# EAGLE design budicLED (EAGLE 7.2.0)
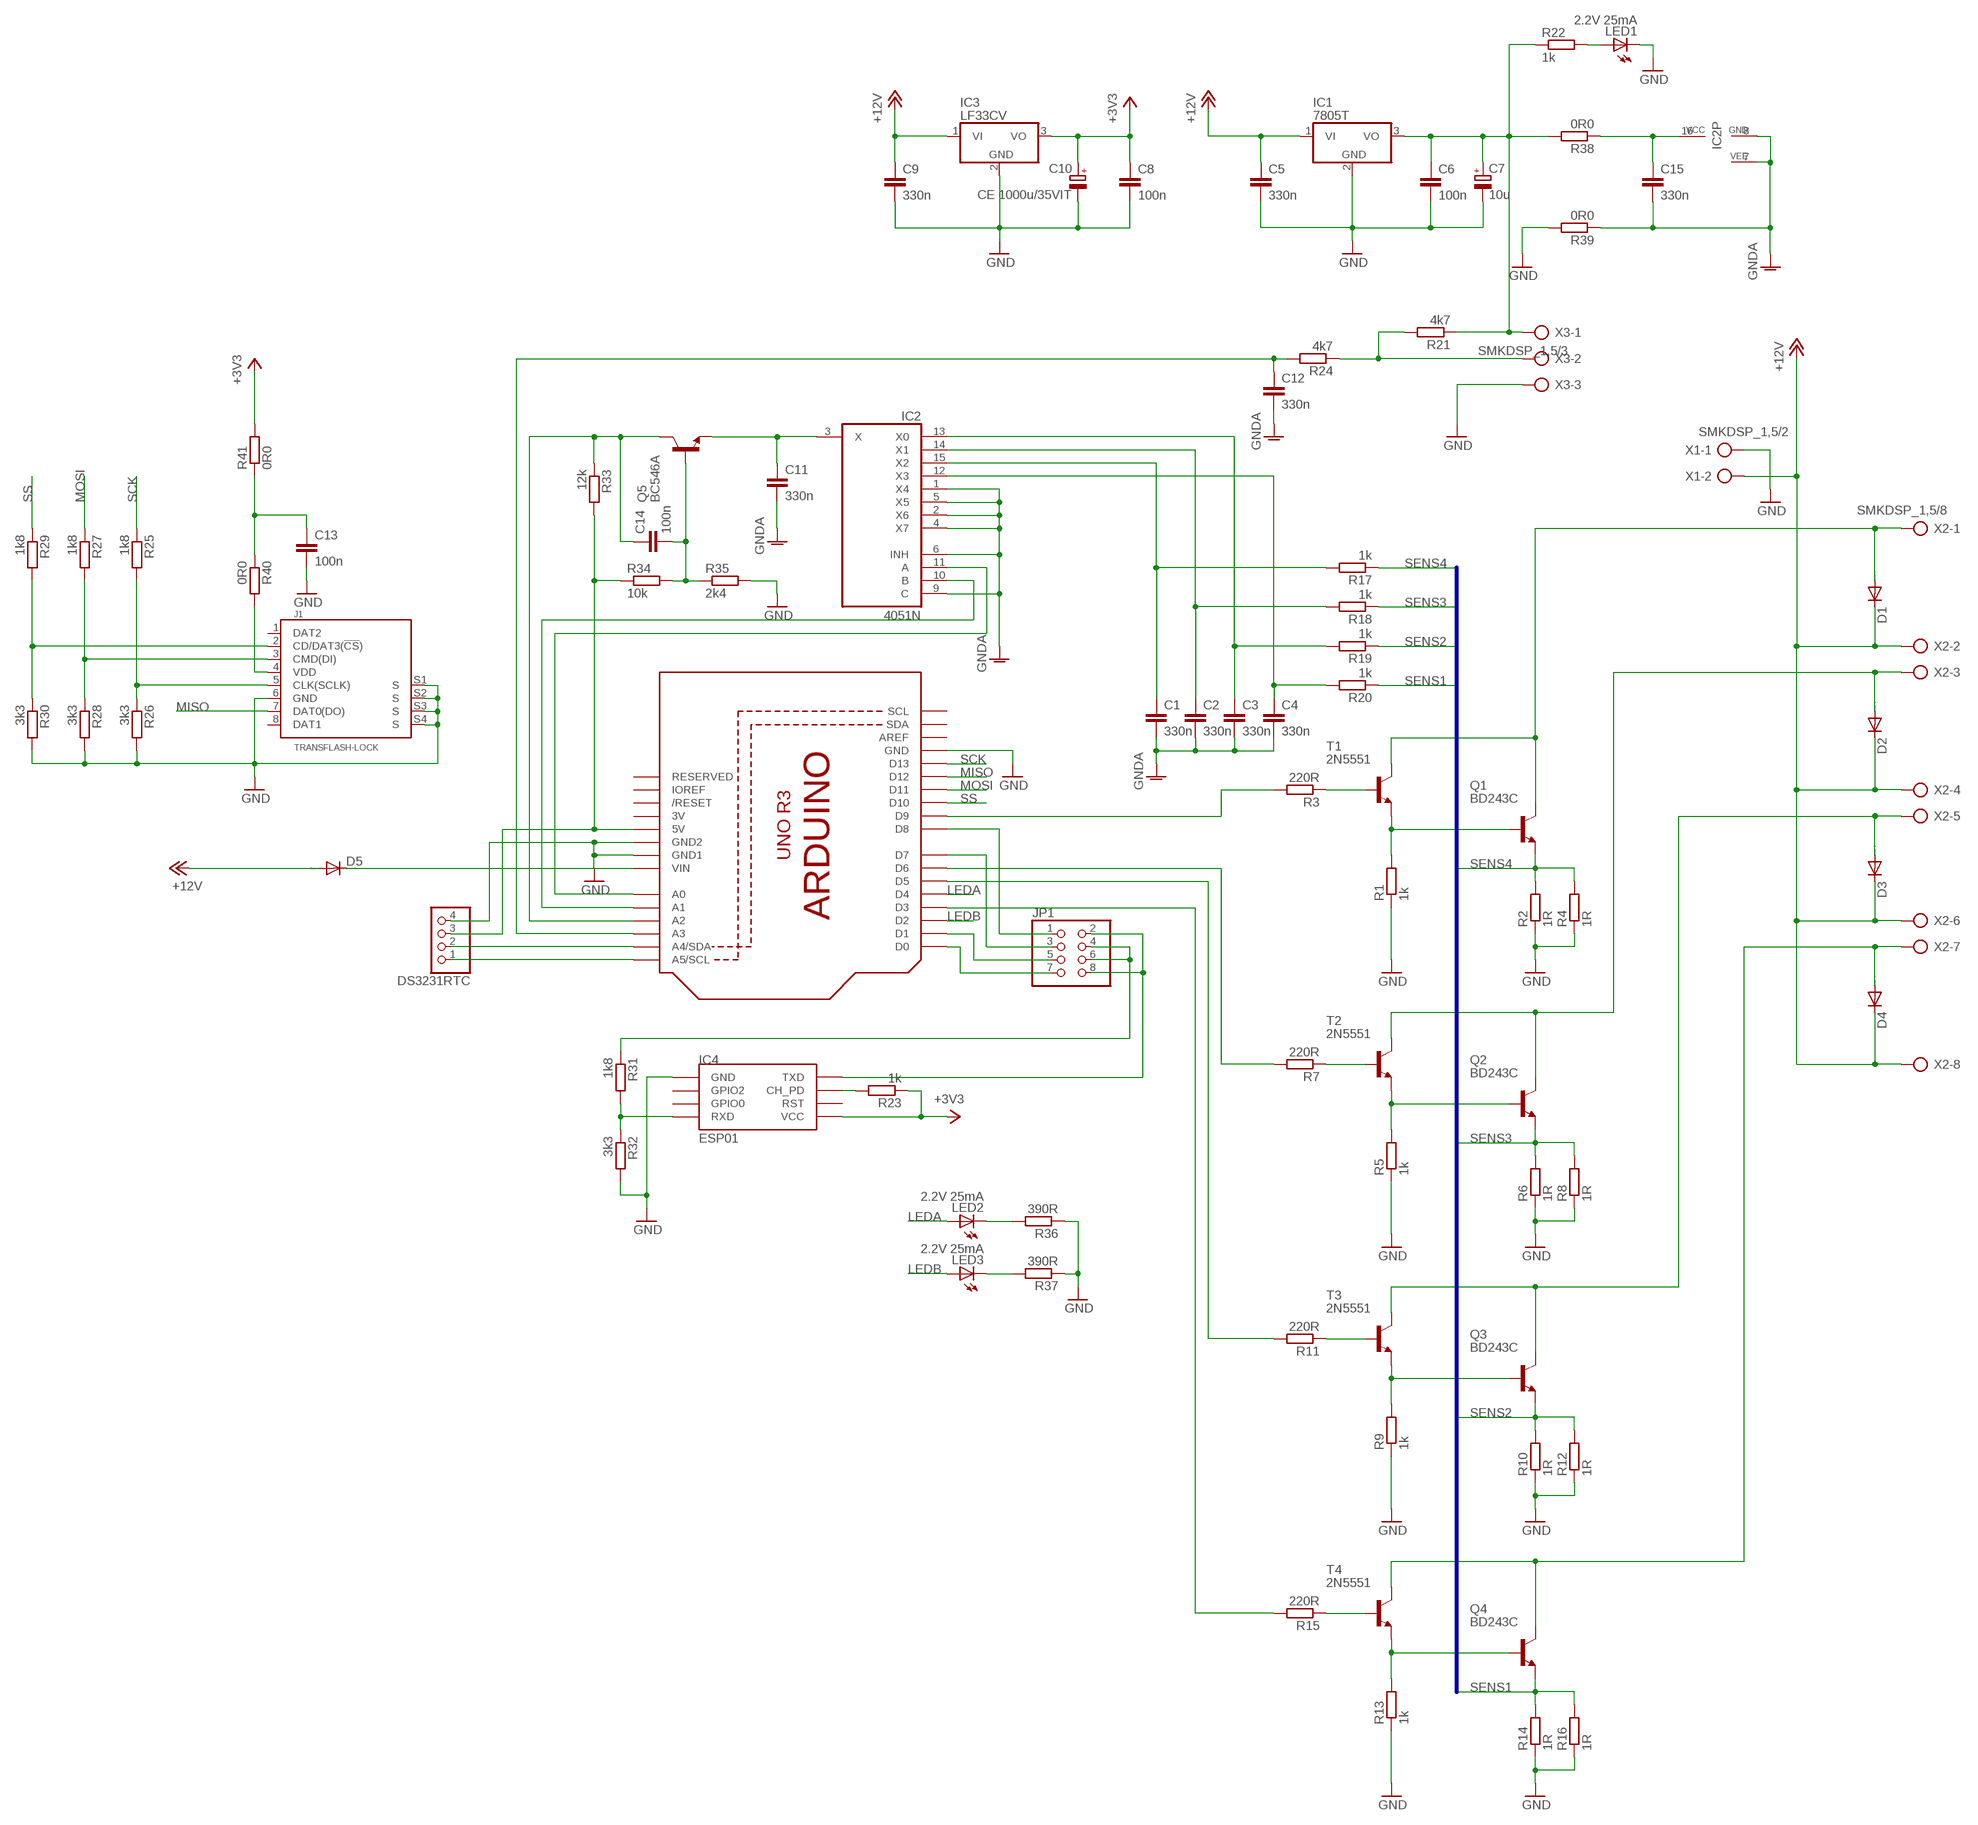
[diagram p0: schematic, sheet 1]

## Parts
C1  330n  C-EUC1206K  [C1206K]
C2  330n  C-EUC1206K  [C1206K]
C3  330n  C-EUC1206K  [C1206K]
C4  330n  C-EUC1206K  [C1206K]
C5  330n  C-EUC1206K  [C1206K]
C6  100n  C-EUC1206K  [C1206K]
C7  10u  CPOL-EUE5-10.5  [E5-10,5]
C8  100n  C-EUC1206K  [C1206K]
C9  330n  C-EUC1206K  [C1206K]
C10  CE 1000u/35VIT  CPOL-EUE5-10.5  [E5-10,5]
C11  330n  C-EUC1206K  [C1206K]
C12  330n  C-EUC1206K  [C1206K]
C13  100n  C-EUC1206K  [C1206K]
C14  100n  C-EUC1206K  [C1206K]
C15  330n  C-EUC1206K  [C1206K]
D1  DIODE-DO201-15  [DO201-15]
D2  DIODE-DO201-15  [DO201-15]
D3  DIODE-DO201-15  [DO201-15]
D4  DIODE-DO201-15  [DO201-15]
D5  DIODE-MELF-MLL41  [MELF-MLL41]
DS3231RTC  PINHD-1X4  [1X04]
IC1  7805T  [TO220H]
IC2  4051N  [DIL16]
IC3  LF33CV  7805T  [TO220H]
IC4  ESP01  [ESP01]
J1  TRANSFLASH-LOCK  [TRANSFLASH-LOCK-SOCK]
JP1  PINHD-2X4  [2X04]
LED1  2.2V 25mA  LED3MM  [LED3MM]
LED2  2.2V 25mA  LED3MM  [LED3MM]
LED3  2.2V 25mA  LED3MM  [LED3MM]
Q1  BD243C  -NPN-TO220  [TO220]
Q2  BD243C  -NPN-TO220  [TO220]
Q3  BD243C  -NPN-TO220  [TO220]
Q4  BD243C  -NPN-TO220  [TO220]
Q5  BC546A  [TO92-EBC]
R1  1k  R-EU_0207/12  [0207/12]
R2  1R  R-EU_0411/15  [0411/15]
R3  220R  R-EU_0207/12  [0207/12]
R4  1R  R-EU_0411/15  [0411/15]
R5  1k  R-EU_0207/12  [0207/12]
R6  1R  R-EU_0411/15  [0411/15]
R7  220R  R-EU_0207/12  [0207/12]
R8  1R  R-EU_0411/15  [0411/15]
R9  1k  R-EU_0207/12  [0207/12]
R10  1R  R-EU_0411/15  [0411/15]
R11  220R  R-EU_0207/12  [0207/12]
R12  1R  R-EU_0411/15  [0411/15]
R13  1k  R-EU_0207/12  [0207/12]
R14  1R  R-EU_0411/15  [0411/15]
R15  220R  R-EU_0207/12  [0207/12]
R16  1R  R-EU_0411/15  [0411/15]
R17  1k  R-EU_R0805  [R0805]
R18  1k  R-EU_R0805  [R0805]
R19  1k  R-EU_R0805  [R0805]
R20  1k  R-EU_R0805  [R0805]
R21  4k7  R-EU_0207/12  [0207/12]
R22  1k  R-EU_R0805  [R0805]
R23  1k  R-EU_R0805  [R0805]
R24  4k7  R-EU_0207/15  [0207/15]
R25  1k8  R-EU_0207/12  [0207/12]
R26  3k3  R-EU_0207/12  [0207/12]
R27  1k8  R-EU_0207/12  [0207/12]
R28  3k3  R-EU_0207/12  [0207/12]
R29  1k8  R-EU_0207/12  [0207/12]
R30  3k3  R-EU_0207/12  [0207/12]
R31  1k8  R-EU_0207/12  [0207/12]
R32  3k3  R-EU_0207/12  [0207/12]
R33  12k  R-EU_0207/12  [0207/12]
R34  10k  R-EU_0207/12  [0207/12]
R35  2k4  R-EU_0207/12  [0207/12]
R36  390R  R-EU_0207/12  [0207/12]
R37  390R  R-EU_0207/12  [0207/12]
R38  0R0  R-EU_0207/15  [0207/15]
R39  0R0  R-EU_0207/12  [0207/12]
R40  0R0  R-EU_0207/12  [0207/12]
R41  0R0  R-EU_0207/12  [0207/12]
T1  2N5551  2N5551-NPN-TO92-CBE  [TO92-CBE]
T2  2N5551  2N5551-NPN-TO92-CBE  [TO92-CBE]
T3  2N5551  2N5551-NPN-TO92-CBE  [TO92-CBE]
T4  2N5551  2N5551-NPN-TO92-CBE  [TO92-CBE]
U1  ARDUINOR3-DIMENSION  [ARDUINOR3]
X1  SMKDSP_1,5/2  [SMKDSP_1,5/2]
X2  SMKDSP_1,5/8  [SMKDSP_1,5/8]
X3  SMKDSP_1,5/3  [SMKDSP_1,5/3]

## Nets
+3V3: C8.1 C10.+ IC3.3(VO) IC4.VCC R23.1 R41.2
+12V: C5.1 C9.1 D1.C D2.C D3.C D4.C D5.A IC1.1(VI) IC3.1(VI) X1.2 X2.2 X2.4 X2.6 X2.8
GND: C5.2 C6.2 C7.- C8.2 C9.2 C10.- C13.2 DS3231RTC.4 IC1.2(GND) IC3.2(GND) IC4.GND J1.6(GND) J1.S1(S) J1.S2(S) J1.S3(S) J1.S4(S) LED1.K(C) R1.1 R2.1 R4.1 R5.1 R6.1 R8.1 R9.1 R10.1 R12.1 R13.1 R14.1 R16.1 R26.2 R28.2 R30.2 R32.2 R35.2 R36.1 R37.1 R39.2 U1.GND U1.GND1 U1.GND2 X1.1 X3.3
GNDA: C1.2 C2.2 C3.2 C4.2 C11.2 C12.2 C15.2 IC2.1(X4) IC2.2(X6) IC2.4(X7) IC2.5(X5) IC2.6(INH) IC2.7(VEE) IC2.8(GND) IC2.9(C) R39.1
LEDA: LED2.A U1.D4
LEDB: LED3.A U1.D2
MISO: J1.7(DAT0(DO)) U1.D12
MOSI: R27.1 U1.D11
N$1: Q1.1(B) R1.2 T1.E
N$2: D1.A Q1.2(C) T1.C X2.1
N$3: R3.1 T1.B
N$4: D2.A Q2.2(C) T2.C X2.3
N$5: D3.A Q3.2(C) T3.C X2.5
N$6: Q2.1(B) R5.2 T2.E
N$7: D4.A Q4.2(C) T4.C X2.7
N$8: R7.1 T2.B
N$9: Q3.1(B) R9.2 T3.E
N$10: R21.2 R24.1 X3.2
N$11: R11.1 T3.B
N$12: Q4.1(B) R13.2 T4.E
N$13: DS3231RTC.1 U1.A5(A5/SCL)
N$14: R15.1 T4.B
N$15: R11.2 U1.D5
N$16: R3.2 U1.D9
N$17: IC4.CH_PD R23.2
N$18: C14.1 Q5.C R33.1 U1.A2
N$19: C14.2 Q5.B R34.2 R35.1
N$20: IC4.TX(TXD) JP1.2 JP1.8
N$21: C12.1 R24.2 U1.A3
N$22: R7.2 U1.D6
N$23: C6.1 C7.+ IC1.3(VO) R21.1 R22.1 R38.2 X3.1
N$24: DS3231RTC.2 U1.A4(A4/SDA)
N$25: JP1.4 JP1.6 R31.1
N$26: IC2.11(A) U1.A0
N$27: LED1.A R22.2
N$28: JP1.3 U1.D7
N$29: C1.1 IC2.15(X2) R17.2
N$30: C2.1 IC2.14(X1) R18.2
N$31: C3.1 IC2.13(X0) R19.2
N$32: J1.5(CLK(SCLK)) R25.2 R26.1
N$33: C4.1 IC2.12(X3) R20.2
N$34: IC2.10(B) U1.A1
N$35: R15.2 U1.D3
N$36: J1.3(CMD(DI)) R27.2 R28.1
N$37: J1.2(CD/DAT3(!CS!)) R29.2 R30.1
N$38: JP1.5 U1.D1
N$39: IC4.RX(RXD) R31.2 R32.1
N$40: C11.1 IC2.3(X) Q5.E
N$41: JP1.7 U1.D0
N$42: JP1.1 U1.D8
N$43: LED2.K(C) R36.2
N$44: DS3231RTC.3 R33.2 R34.1 U1.5V
N$45: LED3.K(C) R37.2
N$46: C15.1 IC2.16(VCC) R38.1
N$47: J1.4(VDD) R40.2
N$48: D5.C U1.VIN
N$49: C13.1 R40.1 R41.1
SCK: R25.1 U1.D13
SENS1: Q4.3(E) R14.2 R16.2 R20.1
SENS2: Q3.3(E) R10.2 R12.2 R19.1
SENS3: Q2.3(E) R6.2 R8.2 R18.1
SENS4: Q1.3(E) R2.2 R4.2 R17.1
SS: R29.1 U1.D10
Unconnected: IC4.GPIO0 IC4.GPIO2 IC4.RST J1.1(DAT2) J1.8(DAT1) U1.AREF U1.IOREF U1.RESERVED U1.RESET(/RESET) U1.SCL U1.SDA

## Buses
SENS[1..4]

## Power pins joined to a net without a drawn wire
3V: U1.3V

## Library data of the parts
C1-C6 C8 C9 C11-C15 = rcl:C-EU: CAPACITOR, European symbol
C7 C10 = resistor:CPOL-EU: POLARIZED CAPACITOR, European symbol
D1-D5 = diode:DIODE-: DIODE
DS3231RTC = pinhead:PINHD-1X4: PIN HEADER
IC1 IC3 = linear:78*: Positive VOLTAGE REGULATOR Source: http://cache.national.com/ds/LM/LM78L05.pdf http://www.fairchildsemi.com/ds/LM/LM7805.pdf
IC2 = 40xx:4051: 8-channel ANALOG MULTIPLEXER
IC4 = esp8266modules:ESP01: ESP8266 Wifi module 01
J1 = sd-mmc:TRANSFLASH: TransFlash TF Micro SD Card Socket Adapter
JP1 = pinhead:PINHD-2X4: PIN HEADER
LED1-LED3 = led:LED: LED OSRAM: - CHIPLED LG R971, LG N971, LY N971, LG Q971, LY Q971, LO R971, LY R971 LH N974, LH R974 LS Q976, LO Q976, LY Q976 LO Q996 - Hyper CHIPLED LW Q18S LB Q993, LB Q99A, LB R99A - SideLED LS A670, LO A670, LY A670, LG A670, LP A670 LB A673, LV A673, LT A673, LW A673 LH A674 LY A675 LS A676, LA A676, LO A676, LY A676, LW A676 LS A679, LY A679, LG A679 - Hyper Micro SIDELED® LS Y876, LA Y876, LO Y876, LY Y876 LT Y87S - SmartLED LW L88C, LW L88S LB L89C, LB L89S, LG L890 LS L89K, LO L89K, LY L89K LS L896, LA L896, LO L896, LY L896 - TOPLED LS T670, LO T670, LY T670, LG T670, LP T670 LSG T670, LSP T670, LSY T670, LOP T670, LYG T670 LG T671, LOG T671, LSG T671 LB T673, LV T673, LT T673, LW T673 LH T674 LS T676, LA T676, LO T676, LY T676, LB T676, LH T676, LSB T676, LW T676 LB T67C, LV T67C, LT T67C, LS T67K, LO T67K, LY T67K, LW E67C LS E67B, LA E67B, LO E67B, LY E67B, LB E67C, LV E67C, LT E67C LW T67C LS T679, LY T679, LG T679 LS T770, LO T770, LY T770, LG T770, LP T770 LB T773, LV T773, LT T773, LW T773 LH T774 LS E675, LA E675, LY E675, LS T675 LS T776, LA T776, LO T776, LY T776, LB T776 LHGB T686 LT T68C, LB T68C - Hyper Mini TOPLED® LB M676 - Mini TOPLED Santana® LG M470 LS M47K, LO M47K, LY M47K Source: http://www.osram.convergy.de LUXEON: - LUMILED® LXK2-PW12-R00, LXK2-PW12-S00, LXK2-PW14-U00, LXK2-PW14-V00 LXK2-PM12-R00, LXK2-PM12-S00, LXK2-PM14-U00 LXK2-PE12-Q00, LXK2-PE12-R00, LXK2-PE12-S00, LXK2-PE14-T00, LXK2-PE14-U00 LXK2-PB12-K00, LXK2-PB12-L00, LXK2-PB12-M00, LXK2-PB14-N00, LXK2-PB14-P00, LXK2-PB14-Q00 LXK2-PR12-L00, LXK2-PR12-M00, LXK2-PR14-Q00, LXK2-PR14-R00 LXK2-PD12-Q00, LXK2-PD12-R00, LXK2-PD12-S00 LXK2-PH12-R00, LXK2-PH12-S00 LXK2-PL12-P00, LXK2-PL12-Q00, LXK2-PL12-R00 Source: www.luxeon.com KINGBRIGHT: KA-3528ASYC Source: www.kingbright.com
Q1-Q4 T1-T4 = transistor:*-NPN-: NPN Transistror BF959 corrected 2008.03.06
Q5 = transistor-npn:BC546*: NPN Transistor
R1-R41 = rcl:R-EU_: RESISTOR, European symbol
U1 = adafruit:ARDUINOR3: This is a new object for the new Arduino R3 - with extra pins that you may want to use (such as IOref, and duplicated A4/A5
X1 = con-phoenix-smkdsp:SMKDSP_1,5/2: Printklemme, Nennstrom: 17,5 A, Bemessungsspannung: 250 V, Raster: 5,0 mm Source: http://eshop.phoenixcontact.de .. 1733415.pdf; MF: FARNELL; MPN: 1733570; OC_FARNELL: 3041244; OC_NEWARK: 69C8588
X2 = con-phoenix-smkdsp:SMKDSP_1,5/8: Printklemme, Nennstrom: 17,5 A, Bemessungsspannung: 250 V, Raster: 5,0 mm Source: http://eshop.phoenixcontact.de .. 1733415.pdf; MF: FARNELL; MPN: 1733635; OC_FARNELL: 3041281; OC_NEWARK: 71C4133
X3 = con-phoenix-smkdsp:SMKDSP_1,5/3: Printklemme, Nennstrom: 17,5 A, Bemessungsspannung: 250 V, Raster: 5,0 mm Source: http://eshop.phoenixcontact.de .. 1733415.pdf; MF: FARNELL; MPN: 1733583; OC_FARNELL: 3041256; OC_NEWARK: 71C4130

## Board
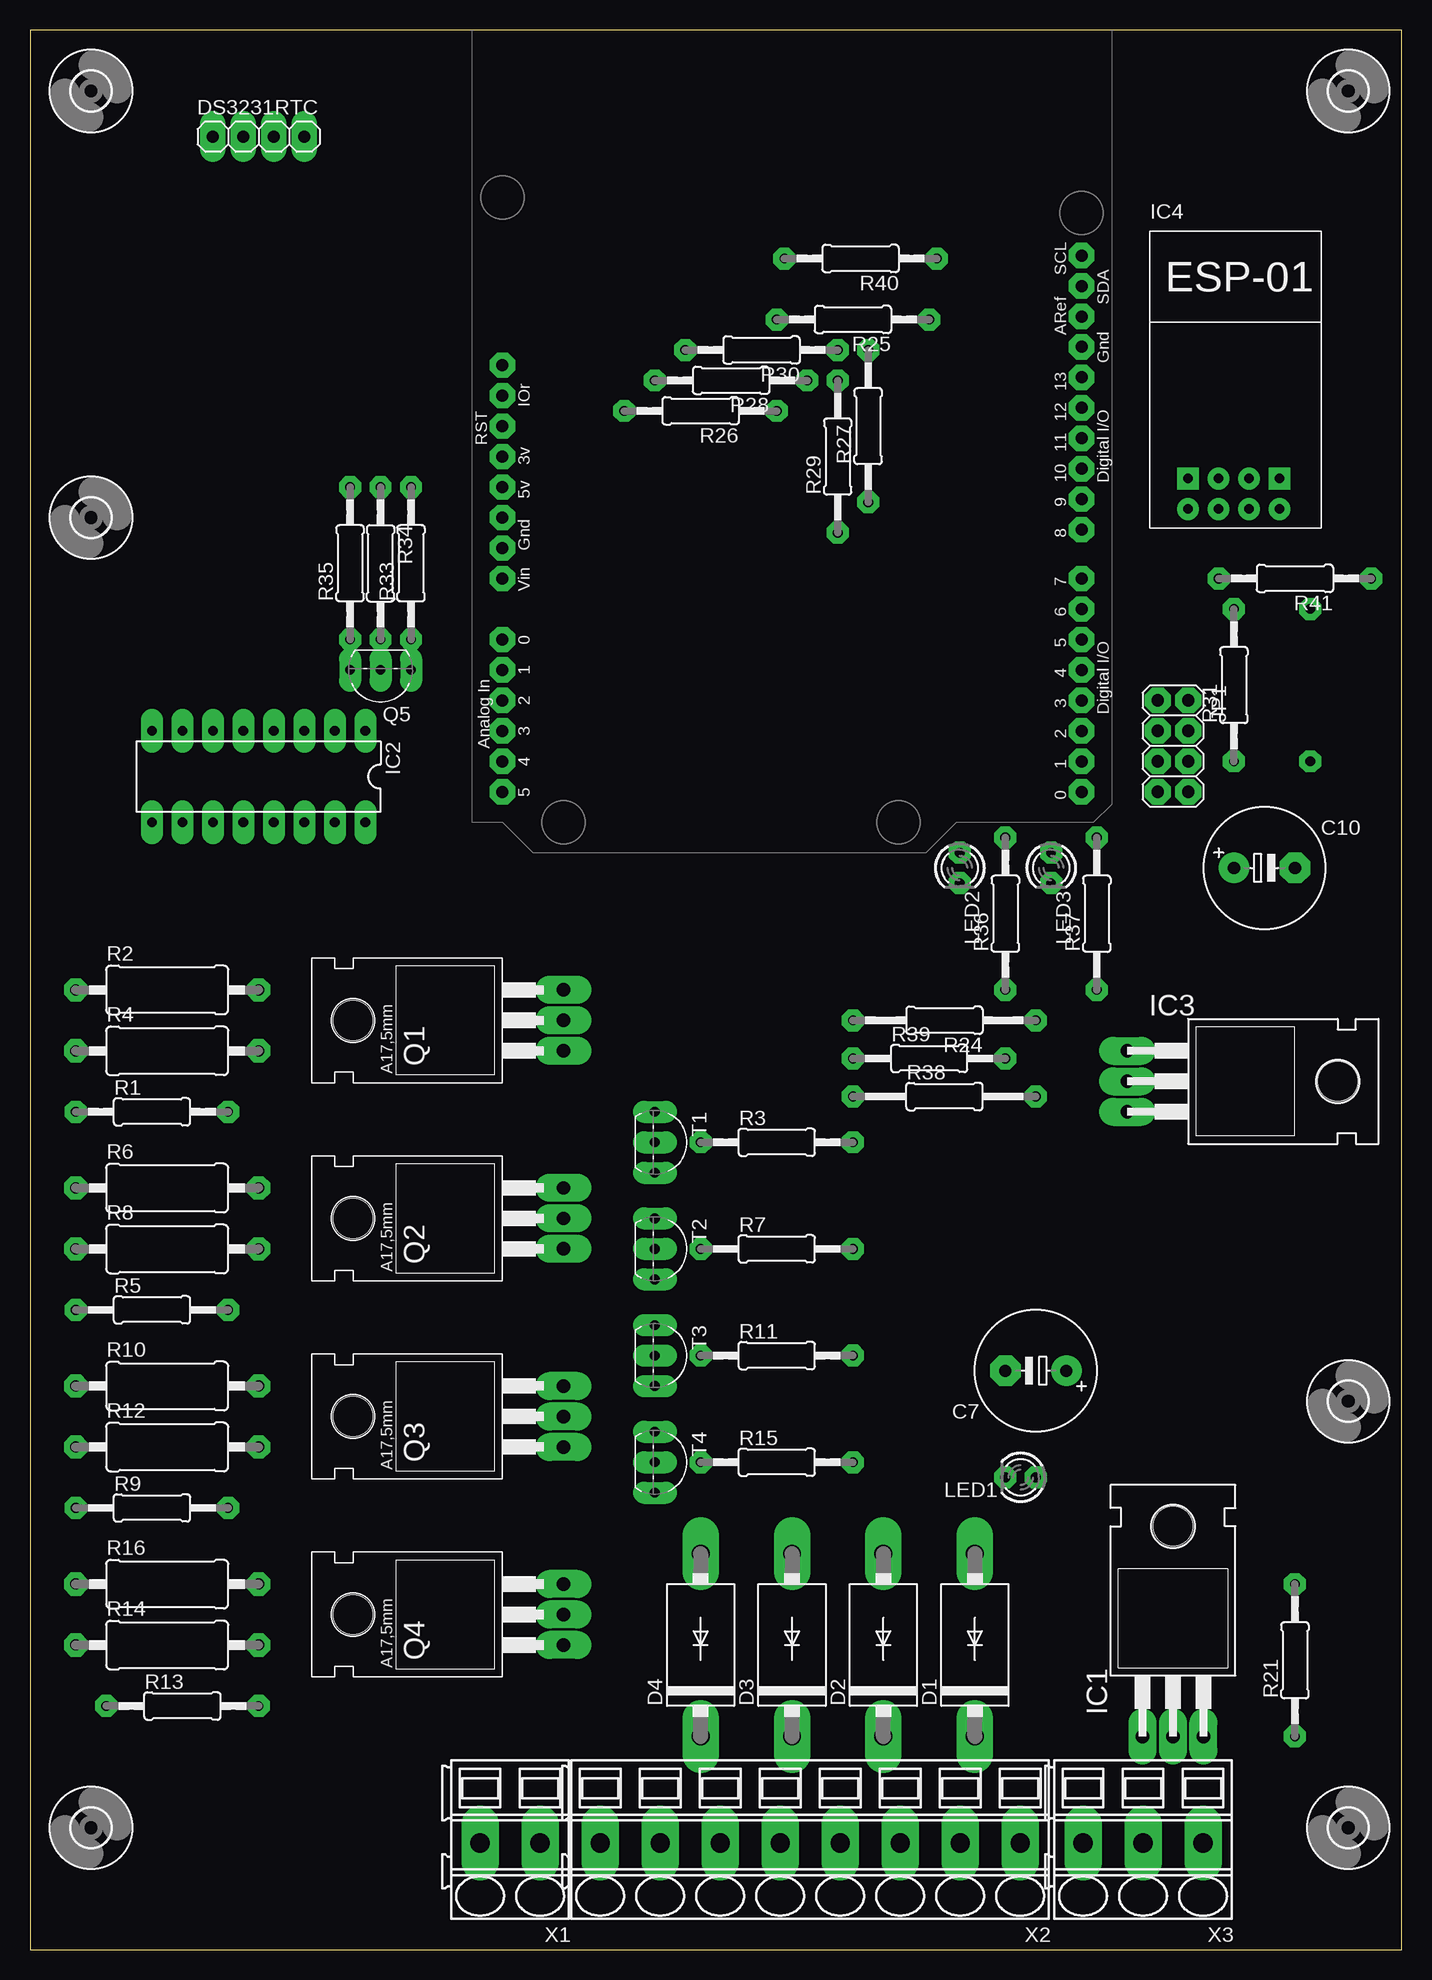
[diagram p1: board, top side]
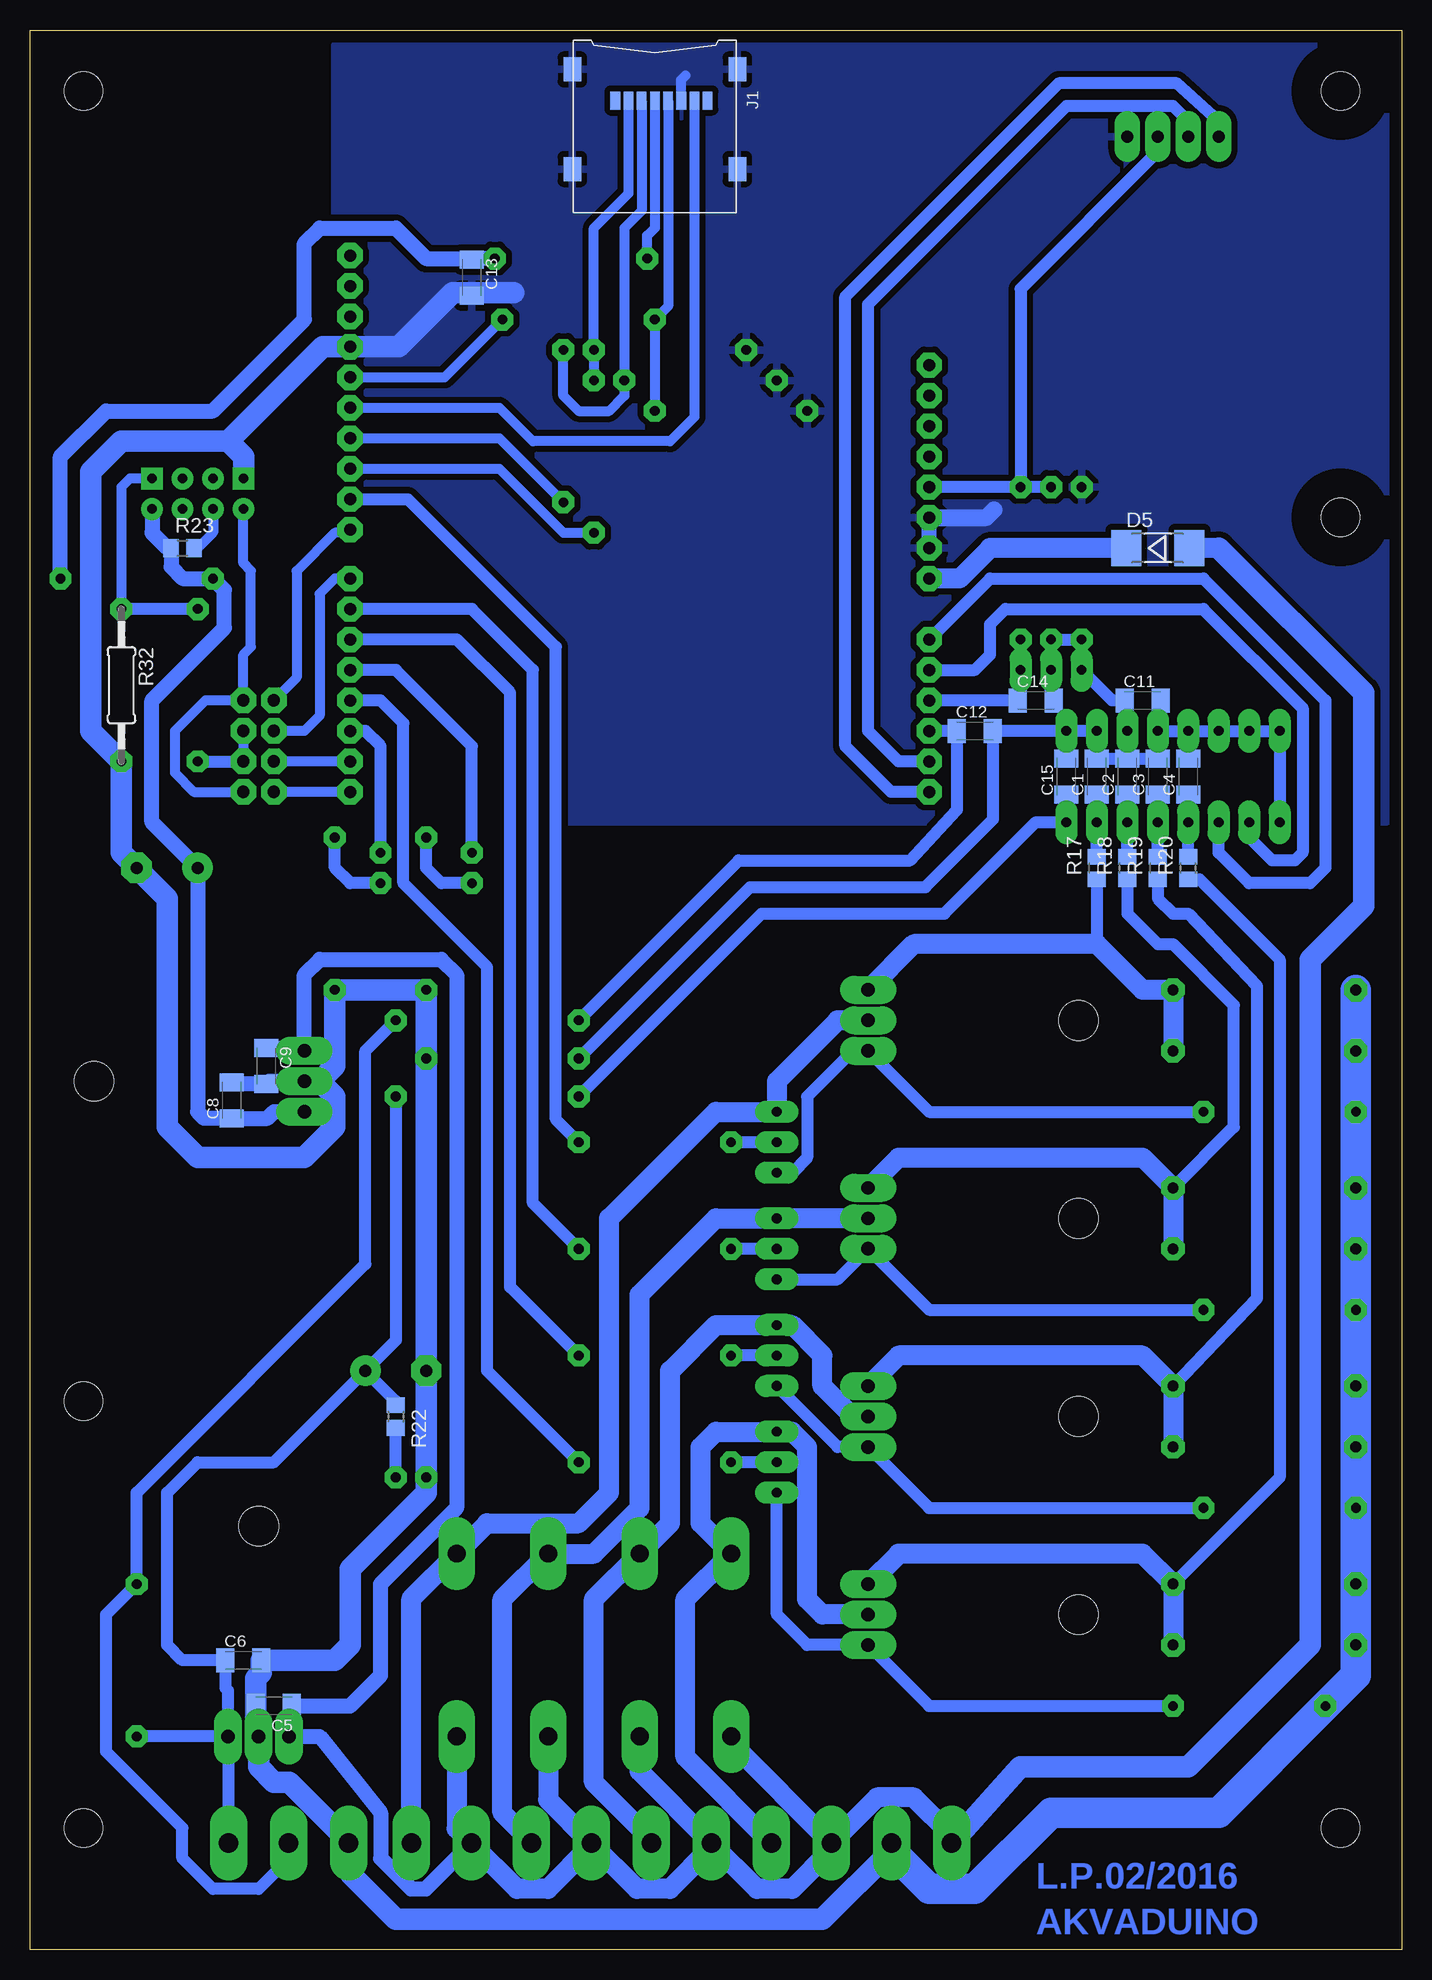
[diagram p2: board, bottom side, seen from below]

Size 114.3 x 160.02 mm. Coordinates in mm from the lower left corner, seen from the top.
Outline: 0,0 114.3,0 114.3,160.02 0,160.02 0,0
Copper layers (1*16): Top 0.035mm / dielectric 1.5mm / Bottom 0.035mm
Design rules "default *": minimum track width 10mil, minimum drill 24mil, track to track 20mil, track to pad 20mil, pad to pad 8mil, via to via 8mil, smd to smd 8mil, copper to edge 40mil, drill to drill 8mil, minimum pad ring 20mil, minimum via ring 8mil, stop-mask expansion 4mil, vias tented up to drill 0mil, thermal gap 20mil

### Footprints (pad centres in the part's own frame; a part is rotated, then mirrored left to right if it is on the bottom)
C1206K = smd 1.5 x 2: 1 -1.5,0; 2 1.5,0
E5-10,5 = drill 1.016 pad 2.54: + -2.54,0 | drill 1.016 pad 2.54 octagon: - 2.54,0
DO201-15 = drill 1.499 long: A 7.62,0; C -7.62,0
MELF-MLL41 = smd 2.5 x 3: A 2.625,0; C -2.625,0
1X04 = drill 1.016 long: 1 -3.81,0; 2 -1.27,0; 3 1.27,0; 4 3.81,0
TO220H = drill 1.118 long: 1 -2.54,-12.7; 2 0,-12.7; 3 2.54,-12.7 | hole 3.302: 0,4.826
DIL16 = drill 0.813 long: 1 -8.89,-3.81; 2 -6.35,-3.81; 3 -3.81,-3.81; 4 -1.27,-3.81; 5 1.27,-3.81; 6 3.81,-3.81; 7 6.35,-3.81; 8 8.89,-3.81; 9 8.89,3.81; 10 6.35,3.81; 11 3.81,3.81; 12 1.27,3.81; 13 -1.27,3.81; 14 -3.81,3.81; 15 -6.35,3.81; 16 -8.89,3.81
ESP01 = drill 0.8: CH_PD -1.285,-8.178; GPIO0 1.255,-5.638; GPIO2 -1.285,-5.638; RST 1.255,-8.178; TX -3.825,-8.178; VCC 3.795,-8.178 | drill 0.8 square: GND -3.825,-5.638; RX 3.795,-5.638
TRANSFLASH-LOCK-SOCK = smd 0.8 x 1.5: 1 3.3,-0.46; 2 2.2,-0.46; 3 1.1,-0.46; 4 0,-0.46; 5 -1.1,-0.46; 6 -2.2,-0.46; 7 -3.3,-0.46; 8 -4.4,-0.46 | smd 1.45 x 2: S1 -6.875,-3.06; S2 -6.875,5.24; S3 6.875,5.24; S4 6.875,-3.06
2X04 = drill 1.016 octagon: 1 -3.81,-1.27; 2 -3.81,1.27; 3 -1.27,-1.27; 4 -1.27,1.27; 5 1.27,-1.27; 6 1.27,1.27; 7 3.81,-1.27; 8 3.81,1.27
LED3MM = drill 0.813 octagon: A -1.27,0; K 1.27,0
TO220 = drill 1.118 long: 1 -2.54,-6.35; 2 0,-6.35; 3 2.54,-6.35 | hole 3.302: 0,11.176
TO92-EBC = drill 0.813 long: B 0,-1.27; C -2.54,-1.27; E 2.54,-1.27
0207/12 = drill 0.813 octagon: 1 -6.35,0; 2 6.35,0
0411/15 = drill 0.914 octagon: 1 -7.62,0; 2 7.62,0
R0805 = smd 1.3 x 1.5: 1 -0.95,0; 2 0.95,0
0207/15 = drill 0.813 octagon: 1 -7.62,0; 2 7.62,0
TO92-CBE = drill 0.813 long: B 0,0; C -2.54,0; E 2.54,0
ARDUINOR3 = drill 1 pad 1.676 octagon: 3V 35.56,2.54; 5V 38.1,2.54; A0 50.8,2.54; A1 53.34,2.54; A2 55.88,2.54; A3 58.42,2.54; A4 60.96,2.54; A5 63.5,2.54; AREF 23.876,50.8; D0 63.5,50.8; D1 60.96,50.8; D2 58.42,50.8; D3 55.88,50.8; D4 53.34,50.8; D5 50.8,50.8; D6 48.26,50.8; D7 45.72,50.8; D8 41.656,50.8; D9 39.116,50.8; D10 36.576,50.8; D11 34.036,50.8; D12 31.496,50.8; D13 28.956,50.8; GND 26.416,50.8; GND1 43.18,2.54; GND2 40.64,2.54; IOREF 30.48,2.54; RESERVED 27.94,2.54; RESET 33.02,2.54; SCL 18.796,50.8; SDA 21.336,50.8; VIN 45.72,2.54
3,2 = hole 3.2: 0,0
SMKDSP_1,5/2 = drill 1.6 pad 1.8 long: 1 -2.5,0; 2 2.5,0
SMKDSP_1,5/8 = drill 1.6 pad 1.8 long: 1 -2.5,0; 2 2.5,0; 3 7.5,0; 4 12.5,0; 5 17.5,0; 6 22.5,0; 7 27.5,0; 8 32.5,0
SMKDSP_1,5/3 = drill 1.6 pad 1.8 long: 1 -2.5,0; 2 2.5,0; 3 7.5,0

### Placement (x,y rotation side)
C1  25.4,97.79 90 bottom
C2  22.86,97.79 90 bottom
C3  20.32,97.79 90 bottom
C4  17.78,97.79 90 bottom
C5  93.98,20.32 180 bottom
C6  96.52,24.13 0 bottom
C7  83.82,48.26 180 top
C8  97.47,70.8 90 bottom
C9  94.61,73.66 270 bottom
C10  102.87,90.17 0 top
C11  21.59,104.14 0 bottom
C12  35.56,101.6 0 bottom
C13  77.47,139.38 270 bottom
C14  30.48,104.14 0 bottom
C15  27.94,97.79 90 bottom
D1  78.74,25.4 90 top
D2  71.12,25.4 90 top
D3  63.5,25.4 90 top
D4  55.88,25.4 90 top
D5  20.32,116.84 0 bottom
DS3231RTC  19.05,151.13 0 top
IC1  95.25,30.48 0 top
IC2  19.05,97.79 180 top
IC3  104.14,72.39 270 top
IC4  100.33,128.27 0 top
J1  62.23,153.67 180 bottom
JP1  95.25,100.33 270 top
LED1  82.55,39.37 180 top
LED2  77.47,90.17 270 top
LED3  85.09,90.17 270 top
Q1  38.1,77.47 90 top
Q2  38.1,60.96 90 top
Q3  38.1,44.45 90 top
Q4  38.1,27.94 90 top
Q5  29.21,105.41 180 top
R1  10.16,69.85 0 top
R2  11.43,80.01 0 top
R3  62.23,67.31 0 top
R4  11.43,74.93 0 top
R5  10.16,53.34 0 top
R6  11.43,63.5 0 top
R7  62.23,58.42 0 top
R8  11.43,58.42 0 top
R9  10.16,36.83 0 top
R10  11.43,46.99 0 top
R11  62.23,49.53 0 top
R12  11.43,41.91 0 top
R13  12.7,20.32 0 top
R14  11.43,25.4 0 top
R15  62.23,40.64 0 top
R16  11.43,30.48 0 top
R17  25.4,90.17 90 bottom
R18  22.86,90.17 90 bottom
R19  20.32,90.17 90 bottom
R20  17.78,90.17 90 bottom
R21  105.41,24.13 90 top
R22  83.82,44.45 270 bottom
R23  101.6,116.84 0 bottom
R24  76.2,77.47 180 top
R25  68.58,135.89 180 top
R26  55.88,128.27 180 top
R27  69.85,127 90 top
R28  58.42,130.81 180 top
R29  67.31,124.46 90 top
R30  60.96,133.35 180 top
R31  100.33,105.41 90 top
R32  106.68,105.41 270 bottom
R33  31.75,115.57 90 top
R34  29.21,115.57 270 top
R35  26.67,115.57 90 top
R36  81.28,86.36 90 top
R37  88.9,86.36 90 top
R38  76.2,71.12 0 top
R39  74.93,74.3 0 top
R40  69.22,140.97 180 top
R41  105.41,114.3 180 top
T1  52.07,67.31 270 top
T2  52.07,58.42 270 top
T3  52.07,49.53 270 top
T4  52.07,40.64 270 top
U1  36.83,160.02 270 top
U$1  [3,2]  5.08,154.94 0 top
U$2  [3,2]  5.08,10.16 0 top
U$3  [3,2]  109.86,10.16 0 top
U$4  [3,2]  5.08,119.38 0 top
U$5  [3,2]  109.86,154.94 0 top
U$6  [3,2]  109.86,45.72 0 top
X1  40.01,8.89 180 top
X2  80.01,8.89 180 top
X3  95.25,8.89 180 top

### Tracks (layer width: path | path; a pad name or v marks a point on that pad's centre or on a via)
+3V3
  Bottom 1.27: IC3.3 93.98,69.85 94.53,69.3 C8.1 99.78,69.3 100.33,69.85 C10.+ 104.14,93.98 104.14,104.14 98.11,110.17 98.11,113.35 R41.2 101.6,114.3 102.55,115.25 R23.1 102.87,116.84 104.14,118.11 104.12,118.12 IC4.VCC
+12V
  Bottom 1.016: X2.8 47.51,8.37 | X2.6 57.51,8.53 | X2.4 67.51,8.69 | 92.48,18.01 IC1.1 | X1.2 37.51,9.56 | D4.C 55.88,17.26
  Bottom 1.27: IC1.1 90.17,17.78 85.09,11.43 85.09,7.62 82.55,5.08 81.32,5.08 X2.2 | 92.48,18.01 C5.1 87.63,20.32 85.09,22.86 85.09,30.48 78.74,36.83 78.74,81.28 80.01,82.55 90.17,82.55 91.44,81.28 IC3.1 91.67,75.16 C9.1
  Bottom 1.676: 57.51,8.53 60.96,5.08 63.7,5.08 X2.4 71.12,12.5 D2.C | 67.51,8.69 71.12,5.08 73.7,5.08 X2.2 78.74,10.12 D1.C | 47.51,8.37 50.8,5.08 53.7,5.08 X2.6 63.5,14.88 D3.C | 37.51,9.56 40.64,12.7 43.7,12.7 X2.8 55.88,17.26 | 15.24,116.84 D5.A
  Bottom 1.778: 15.24,116.84 3.17,104.78 3.17,87 7.62,82.55 7.62,25.4 17.78,15.24 31.79,15.24 X1.2
GND
  Bottom 0.813: J1.6 60.03,155.87 59.69,156.21
  Bottom 1.016: X1.1 42.51,8.29 | 87.63,8.77 X3.3 87.75,9.01 | 95.48,18.01 IC1.2 | 94.39,72.39 C9.2
  Bottom 1.27: U1.GND1 U1.GND2 | IC3.2 94.39,72.39 | C9.2 97.33,72.16 C8.2
  Bottom 1.422: U1.GND2 34.61,119.38 33.97,120.02
  Bottom 1.676: 42.51,8.29 42.51,8.21
  Bottom 1.778: 42.51,8.29 48.26,2.54 83.82,2.54 87.63,6.35 87.63,8.77 | 95.48,18.01 C5.2 95.48,22.63 95.02,23.09 C6.2 88.9,24.13 87.63,25.4 87.63,31.75 81.28,38.1 LED1.K C7.- R39.2 R36.1 R37.1 88.9,73.66 90.17,72.39 | 87.75,9.01 92.71,13.97 93.98,13.97 95.25,15.24 IC1.2 | 90.17,72.39 IC3.2 | 90.17,72.39 88.9,71.12 88.9,68.58 91.44,66.04 100.33,66.04 102.87,68.58 102.87,87.63 C10.- 106.68,91.44 R32.2 109.22,101.6 109.22,123.19 106.68,125.73 97.79,125.73 | IC4.GND 96.5,124.44 97.79,125.73 | 97.79,125.73 89.92,133.6 U1.GND 83.57,133.6 79.06,138.11 73.98,138.11
  Bottom 2.54: R2.1 R4.1 R1.1 R6.1 R8.1 R5.1 R10.1 R12.1 R9.1 R16.1 R14.1 3.81,22.86 R13.1 15.24,11.43 29.21,11.43 35.56,5.08 39.37,5.08 42.51,8.21
  pour Bottom: 88.9,93.98 1.27,93.98 1.27,158.75 88.9,158.75
GNDA
  Bottom 1.016: R39.1 54.29,88.58 39.69,88.58 34.06,94.21 C12.2 IC2.1 | IC2.4 20.32,103.91 C11.2 | IC2.1 C15.2 | IC2.4 C3.2 C2.2 C1.2 IC2.2 IC2.1 | IC2.4 IC2.5 | IC2.5 C4.2 | IC2.5 IC2.6 IC2.7 IC2.8 IC2.9
LEDA
  Bottom 1.016: LED2.A 77.47,100.33 83.82,106.68 U1.D4
LEDB
  Bottom 1.016: LED3.A 85.09,100.33 86.36,101.6 U1.D2
MISO
  Bottom 0.813: U1.D12 75.18,128.52 72.39,125.73 60.96,125.73 58.93,127.76 J1.7
MOSI
  Bottom 0.813: U1.D11 75.18,125.98 R27.1
N$1
  Bottom 1.016: T1.E 50.8,64.77 49.53,66.04 49.53,71.12 45.72,74.93 Q1.1 39.37,69.85 R1.2
N$2
  Bottom 1.676: X2.1 82.51,29.25 D1.A 76.2,35.56 68.58,35.56 66.04,38.1 66.04,60.96 57.15,69.85 T1.C 52.07,72.39 46.99,77.47 Q1.2
N$3
  Bottom 1.016: T1.B R3.1
N$4
  Bottom 1.016: X2.3 72.51,9.01
  Bottom 1.676: 72.51,9.01 74.93,11.43 74.93,29.21 D2.A 67.31,33.02 63.5,36.83 63.5,54.61 57.15,60.96 T2.C Q2.2
N$5
  Bottom 1.016: X2.5 62.51,9.17
  Bottom 1.676: 62.51,9.17 67.31,13.97 67.31,29.21 D3.A 60.96,35.56 60.96,48.26 57.15,52.07 T3.C 50.8,52.07 48.26,49.53 48.26,46.99 45.72,44.45 Q3.2
N$6
  Bottom 1.016: T2.E 46.99,55.88 Q2.1 39.37,53.34 R5.2
N$7
  Bottom 1.676: Q4.2 48.26,27.94 49.53,29.21 49.53,41.91 50.8,43.18 T4.C 57.15,43.18 58.42,41.91 58.42,35.56 D4.A 59.69,29.21 59.69,16.07 X2.7
N$8
  Bottom 1.016: T2.B R7.1
N$9
  Bottom 1.016: T3.E 46.99,41.91 Q3.1 39.37,36.83 R9.2
N$10
  Bottom 1.016: X3.2 92.75,7.58 95.25,5.08 99.06,5.08 101.6,7.62 101.6,10.16 107.95,16.51 107.95,27.94 R21.2 105.41,38.1 86.36,57.15 86.36,74.93 R24.1
N$11
  Bottom 1.016: T3.B R11.1
N$12
  Bottom 1.016: T4.E 52.07,27.94 49.53,25.4 Q4.1 39.37,20.32 R13.2
N$13
  Bottom 1.016: U1.A5 42.55,96.52 46.35,100.33 46.35,137.79 28.57,155.57 18.73,155.57 15.24,152.4 DS3231RTC.1
N$14
  Bottom 1.016: T4.B R15.1
N$15
  Bottom 1.016: R11.2 74.3,55.24 74.3,104.78 78.74,109.22 U1.D5
N$16
  Bottom 1.016: R3.2 70.48,69.22 70.48,108.58 82.8,120.9 U1.D9
N$17
  Bottom 0.813: R23.2 100.33,116.84 99.05,118.12 IC4.CH_PD
N$18
  Bottom 1.016: U1.A2 C14.1 31.75,104.37 Q5.C R33.1
N$19
  Bottom 1.016: C14.2 29.21,104.41 Q5.B R34.2 R35.1
N$20
  Bottom 0.813: JP1.8 100.65,96.52 102.23,98.11 102.23,101.6 99.69,104.14 JP1.2 96.52,107.95 95.89,108.58 95.89,114.94 96.52,115.57 96.52,120.08 IC4.TX
N$21
  Bottom 1.016: U1.A3 C12.1 37.06,95.02 40.96,90.81 55.24,90.81 R24.2
N$22
  Bottom 1.016: R7.2 72.39,62.23 72.39,106.68 77.47,111.76 U1.D6
N$23
  Bottom 1.016: IC1.3 97.79,8.93 X3.1 | IC1.3 97.79,21.59 98.02,21.82 C6.1 101.6,24.13 102.87,25.4 102.87,38.1 100.33,40.64 93.98,40.64 C7.+ | IC1.3 R21.1 | C7.+ 83.82,45.72 R22.1 | R38.2 83.82,50.8 C7.+
N$24
  Bottom 1.016: U1.A4 41.91,99.06 44.45,101.6 44.45,137.16 27.94,153.67 19.05,153.67 17.78,152.4 DS3231RTC.2
N$25
  Bottom 0.813: JP1.4 JP1.6
  Bottom 1.016: R31.1 JP1.6
N$26
  Bottom 1.016: IC2.11 15.24,91.44 12.7,88.9 7.62,88.9 6.35,90.17 6.35,104.14 16.51,114.3 34.29,114.3 U1.A0
N$27
  Bottom 1.016: LED1.A R22.2
N$28
  Bottom 0.813: U1.D7 88.9,114.3 90.17,113.03 90.17,102.87 91.44,101.6 JP1.3
N$29
  Bottom 1.016: R17.2 IC2.15 C1.1
N$30
  Bottom 1.016: R18.2 IC2.14 C2.1
N$31
  Bottom 1.016: R19.2 IC2.13 C3.1
N$32
  Bottom 0.813: J1.5 61.13,136.99 R25.2 R26.1
N$33
  Bottom 1.016: R20.2 IC2.12 C4.1
N$34
  Bottom 1.016: IC2.10 12.7,92.71 10.79,90.81 8.89,90.81 8.26,91.44 8.26,103.5 16.51,111.76 33.02,111.76 34.29,110.49 34.29,107.95 35.56,106.68 U1.A1
N$35
  Bottom 1.016: R15.2 76.2,48.26 76.2,81.92 83.19,88.9 83.19,102.23 85.09,104.14 U1.D3
N$36
  Bottom 0.813: J1.3 63.33,144.95 64.77,143.51 R28.1 64.77,129.54 66.04,128.27 68.58,128.27 69.85,129.54 R27.2
N$37
  Bottom 0.813: R29.2 R30.1 67.31,143.51 64.43,146.39 J1.2
N$38
  Bottom 0.813: U1.D1 JP1.5
N$39
  Bottom 0.813: IC4.RX 105.97,122.63 106.68,121.92 R32.1
  Bottom 1.016: R31.2 R32.1
N$40
  Bottom 1.016: Q5.E 24.13,104.14 C11.1 23.09,101.83 IC2.3
N$41
  Bottom 0.813: U1.D0 JP1.7
N$42
  Bottom 0.813: U1.D8 87.63,118.11 88.9,118.11 92.08,114.94 92.08,106.05 JP1.1
N$43
  Bottom 1.016: LED2.K 80.01,88.9 81.28,90.17 R36.2
N$44
  Bottom 1.016: R34.1 R33.2 | DS3231RTC.3 20.32,149.86 31.75,138.43 R33.2 | R33.2 U1.5V
N$45
  Bottom 1.016: LED3.K 87.63,88.9 88.9,90.17 R37.2
N$46
  Bottom 1.016: R38.1 53.34,86.36 38.1,86.36 30.48,93.98 IC2.16 C15.1
N$47
  Bottom 0.813: J1.4 62.23,143.51 62.87,142.88 R40.2
N$48
  Bottom 1.676: D5.C 34.29,116.84 36.83,114.3 U1.VIN
N$49
  Bottom 1.27: R41.1 111.76,124.46 107.95,128.27 99.06,128.27 91.44,135.89 91.44,142.24 90.17,143.51 83.82,143.51 81.28,140.97 77.56,140.97 C13.1 77.38,140.97 R40.1
SCK
  Bottom 0.813: U1.D13 79.76,131.06 R25.1
SENS1
  Bottom 1.016: R20.1 16.83,89.22 10.16,82.55 10.16,39.37 R16.2
  Bottom 1.676: R14.2 R16.2 21.59,33.02 41.91,33.02 Q4.3
SENS2
  Bottom 1.016: R19.1 20.32,87.63 19.05,86.36 17.78,86.36 12.06,80.33 12.06,54.29 R10.2
  Bottom 1.676: R12.2 R10.2 21.59,49.53 41.91,49.53 Q3.3
SENS3
  Bottom 1.016: R18.1 22.86,86.36 20.32,83.82 19.05,83.82 13.97,78.74 13.97,68.58 R6.2
  Bottom 1.676: R8.2 R6.2 21.59,66.04 41.91,66.04 Q2.3
SENS4
  Bottom 1.016: R17.1 25.4,83.82
  Bottom 1.676: R4.2 R2.2 21.59,80.01 25.4,83.82 40.64,83.82 Q1.3
SS
  Bottom 0.813: U1.D10 75.18,123.44 69.85,118.11 R29.1

### Text on the board
Bottom: L.P.02/2016 | AKVADUINO